# EAGLE design 2mono (EAGLE 6.1)
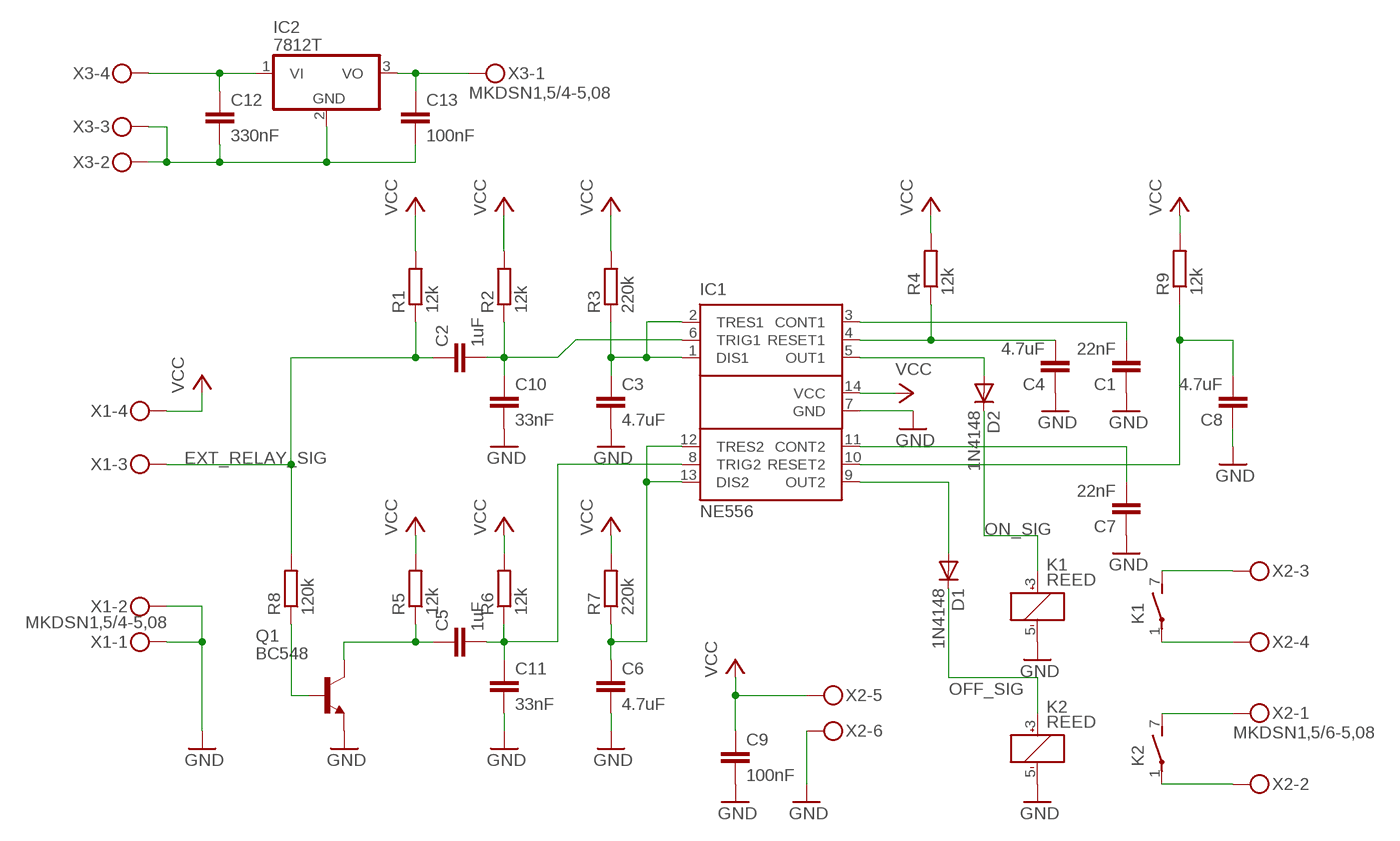
[diagram p0: schematic, sheet 1]

## Parts
C1  22nF  C-EU050-025X075  [C050-025X075]
C2  1uF  C-EU025-030X050  [C025-030X050]
C3  4.7uF  C-EU025-030X050  [C025-030X050]
C4  4.7uF  C-EU025-030X050  [C025-030X050]
C5  1uF  C-EU025-030X050  [C025-030X050]
C6  4.7uF  C-EU025-030X050  [C025-030X050]
C7  22nF  C-EU050-025X075  [C050-025X075]
C8  4.7uF  C-EU025-030X050  [C025-030X050]
C9  100nF  C-EU075-042X103  [C075-042X103]
C10  33nF  C-EU050-030X075  [C050-030X075]
C11  33nF  C-EU050-030X075  [C050-030X075]
C12  330nF  C-EU075-032X103  [C075-032X103]
C13  100nF  C-EU075-042X103  [C075-042X103]
D1  1N4148  1N4148DO35-10  [DO35-10]
D2  1N4148  1N4148DO35-10  [DO35-10]
IC1  NE556  [DIL14]
IC2  7812T  [TO220H]
K1  REED  [REED]
K2  REED  [REED]
Q1  BC548  [TO92-EBC]
R1  12k  R-EU_0207/12  [0207/12]
R2  12k  R-EU_0207/12  [0207/12]
R3  220k  R-EU_0207/12  [0207/12]
R4  12k  R-EU_0207/12  [0207/12]
R5  12k  R-EU_0207/12  [0207/12]
R6  12k  R-EU_0207/12  [0207/12]
R7  220k  R-EU_0207/12  [0207/12]
R8  120k  R-EU_0207/12  [0207/12]
R9  12k  R-EU_0207/12  [0207/12]
X1  MKDSN1,5/4-5,08  [MKDSN1,5/4-5,08]
X2  MKDSN1,5/6-5,08  [MKDSN1,5/6-5,08]
X3  MKDSN1,5/4-5,08  [MKDSN1,5/4-5,08]

## Nets
EXT_RELAY_SIG: C2.1 R1.1 R8.2 X1.3
GND: C1.1 C3.2 C4.1 C6.2 C7.1 C8.1 C9.2 C10.2 C11.2 IC1.7(GND) K1.5(1:-) K2.5(1:-) Q1.E X1.1 X1.2 X2.6
N$1: C3.1 IC1.1(DIS1) IC1.2(TRES1) R3.1
N$2: C2.2 C10.1 IC1.6(TRIG1) R2.1
N$3: C6.1 IC1.12(TRES2) IC1.13(DIS2) R7.1
N$4: C1.2 IC1.3(CONT1)
N$5: C4.2 IC1.4(RESET1) R4.1
N$6: C5.1 Q1.C R5.1
N$7: Q1.B R8.1
N$9: C5.2 C11.1 IC1.8(TRIG2) R6.1
N$10: C7.2 IC1.11(CONT2)
N$11: C8.2 IC1.10(RESET2) R9.1
N$12: D2.A IC1.5(OUT1)
N$14: K2.7(2:S) X2.1
N$15: K2.1(2:P) X2.2
N$16: K1.1(2:P) X2.4
N$17: D1.A IC1.9(OUT2)
N$19: C12.1 IC2.1(VI) X3.4
N$20: K1.7(2:S) X2.3
N$21: C13.1 IC2.3(VO) X3.1
N$22: C12.2 C13.2 IC2.2(GND) X3.2 X3.3
OFF_SIG: D1.C K2.3(1:+)
ON_SIG: D2.C K1.3(1:+)
VCC: C9.1 IC1.14(VCC) R1.2 R2.2 R3.2 R4.2 R5.2 R6.2 R7.2 R9.2 X1.4 X2.5

## Library data of the parts
C1-C13 = resistor:C-EU: CAPACITOR, European symbol
D1 D2 = diode:1N4148: DIODE high speed (Philips)
IC1 = st-microelectronics:NE556: General Purpose Biopolartimer
IC2 = linear:78*: Positive VOLTAGE REGULATOR Source: http://cache.national.com/ds/LM/LM78L05.pdf http://www.fairchildsemi.com/ds/LM/LM7805.pdf
K1 K2 = relay:REED: RELAY reed, 1 x norm. open with polarity, grid 5.08
Q1 = transistor-npn:BC548*: NPN Transistor
R1-R9 = resistor:R-EU_: RESISTOR, European symbol
X1 X3 = con-phoenix-508:MKDSN1,5/4-5,08: MKDSN 1,5/ 4-5,08 Printklemme Nennstrom: 13,5 A Nennspannung: 250 V Rastermaß: 5,08 mm Polzahl: 4 Anschlussart: Schraubanschluss Montage: Löten Anschlussrichtung Leiter/Platine: 0 ° Artikelnummer: 1729144 Source: http://eshop.phoenixcontact.com .. 1729144.pdf
X2 = con-phoenix-508:MKDSN1,5/6-5,08: MKDSN 1,5/ 6-5,08 Printklemme Nennstrom: 13,5 A Nennspannung: 250 V Rastermaß: 5,08 mm Polzahl: 6 Anschlussart: Schraubanschluss Montage: Löten Anschlussrichtung Leiter/Platine: 0 ° Artikelnummer: 1729160 Source: http://eshop.phoenixcontact.com .. 1729160.pdf

## Board
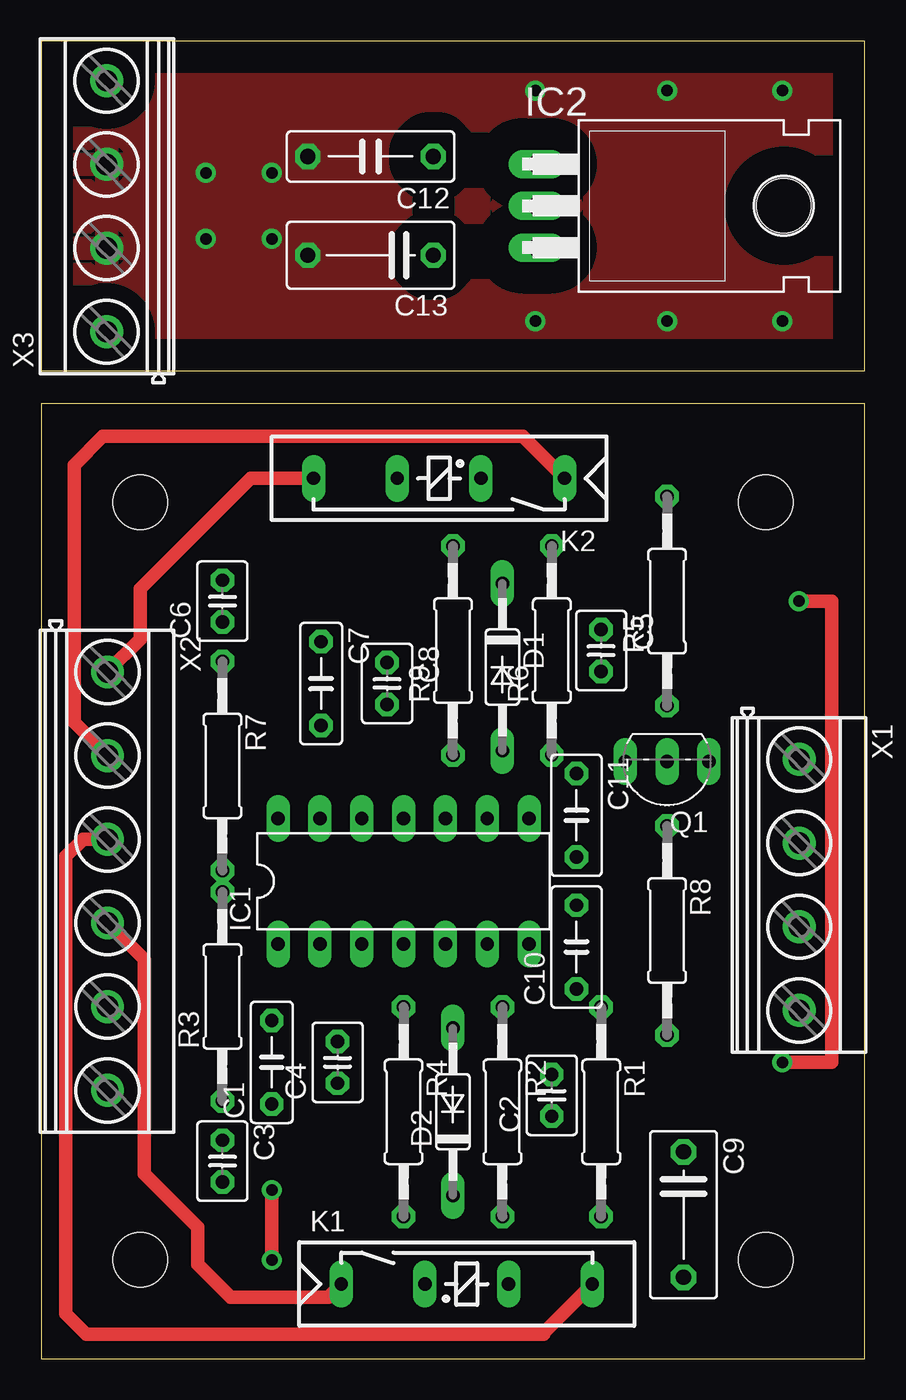
[diagram p1: board, top side]
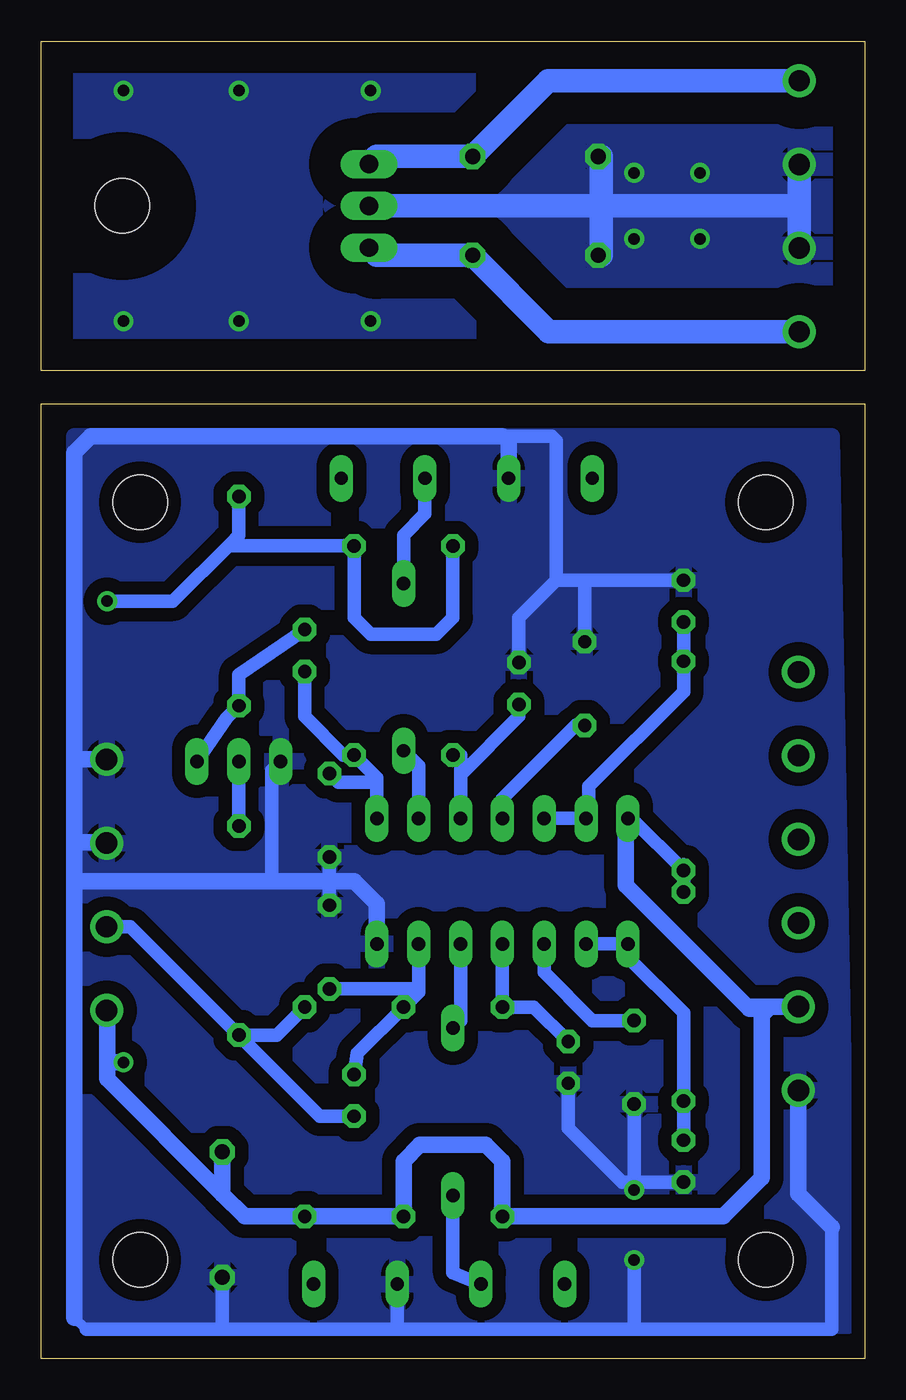
[diagram p2: board, bottom side, seen from below]

Size 50 x 80 mm. Coordinates in mm from the lower left corner, seen from the top.
Outline: 0,0 50,0 50,58 0,58 0,0
Outline: 0,80 0,60 50,60 50,80 0,80
Copper layers (1*16): Top 0.035mm / dielectric 1.5mm / Bottom 0.035mm
Design rules: minimum track width 8mil, minimum drill 20mil, track to track 8mil, track to pad 8mil, pad to pad 8mil, via to via 8mil, smd to smd 8mil, copper to edge 10mil, drill to drill 8mil, minimum pad ring 12mil, minimum via ring 10mil, stop-mask expansion 4mil, vias tented up to drill 25mil, thermal gap 10mil
Holes 3.3 mm at 6,6 6,52 44,52 44,6

### Footprints (pad centres in the part's own frame; a part is rotated, then mirrored left to right if it is on the bottom)
C050-025X075 = drill 0.813 octagon: 1 -2.54,0; 2 2.54,0
C025-030X050 = drill 0.813 octagon: 1 -1.27,0; 2 1.27,0
C075-042X103 = drill 0.914 octagon: 1 -3.81,0; 2 3.81,0
C050-030X075 = drill 0.813 octagon: 1 -2.54,0; 2 2.54,0
C075-032X103 = drill 0.914 octagon: 1 -3.81,0; 2 3.81,0
DO35-10 = drill 0.813 long: A 5.08,0; C -5.08,0
DIL14 = drill 0.813 long: 1 -7.62,-3.81; 2 -5.08,-3.81; 3 -2.54,-3.81; 4 0,-3.81; 5 2.54,-3.81; 6 5.08,-3.81; 7 7.62,-3.81; 8 7.62,3.81; 9 5.08,3.81; 10 2.54,3.81; 11 0,3.81; 12 -2.54,3.81; 13 -5.08,3.81; 14 -7.62,3.81
TO220H = drill 1.118 long: 1 -2.54,-10.16; 2 0,-10.16; 3 2.54,-10.16 | hole 3.302: 0,4.826
REED = drill 0.813 long: 1 -17.78,2.54; 3 -12.7,2.54; 5 -7.62,2.54; 7 -2.54,2.54
TO92-EBC = drill 0.813 long: B 0,-1.27; C -2.54,-1.27; E 2.54,-1.27
0207/12 = drill 0.813 octagon: 1 -6.35,0; 2 6.35,0
MKDSN1,5/4-5,08 = drill 1.3 pad 2: 1 -7.641,0.025; 2 -2.561,0.025; 3 2.519,0.025; 4 7.599,0.025
MKDSN1,5/6-5,08 = drill 1.3 pad 2: 1 -12.7,0.025; 2 -7.62,0.025; 3 -2.54,0.025; 4 2.54,0.025; 5 7.62,0.025; 6 12.7,0.025

### Placement (x,y rotation side)
C1  14,18 90 top
C2  31,16 90 top
C3  11,12 270 top
C4  18,18 90 top
C5  34,43 270 top
C6  11,46 90 top
C7  17,41 270 top
C8  21,41 270 top
C9  39,8.75 270 top
C10  32.5,25 90 top
C11  32.5,33 270 top
C12  20,73 180 top
C13  20,67 180 top
D1  28,42 270 top
D2  25,15 90 top
IC1  22,29 0 top
IC2  40.25,70 270 top
K1  36,2 0 top
K2  14,56 180 top
Q1  38,35 180 top
R1  34,15 270 top
R2  28,15 270 top
R3  11,22 90 top
R4  22,15 270 top
R5  38,46 90 top
R6  31,43 90 top
R7  11,36 270 top
R8  38,26 270 top
R9  25,43 90 top
X1  46,28.75 270 top
X2  4,29 270 top
X3  4,70 90 top

### Tracks (layer width: path | path; a pad name or v marks a point on that pad's centre or on a via)
EXT_RELAY_SIG
  Bottom 0.813: X1.3 44.58,26.23 R8.2 | R8.2 37.19,19.65 | C2.1 33.08,14.73 R8.2 | R1.1 35.7,19.65 R8.2
GND  (via drill 0.7)
  Top 0.813: v14,6 v14,10.25
  Bottom 0.61: 47.25,1.8 48,2.5
  Bottom 0.813: 14,10.73 C3.2 13.73,10.73 14,11 | 14,10.73 14.73,10.73 18,14 C4.1 | 14,10.73 14,11 | 14,11 C1.1 | v14,10.25 14,10.73 | 14,1.8 v14,6 | 2,8 2,1.8 14,1.8 | 47.62,31.38 48,31 48,36.25 48,36.39 | 17,47.27 C6.2 | 18.73,47.27 17,47.27 | 18.73,47.27 21,45 C8.1 | 17,47.27 C7.1 | 18.73,47.27 18.73,55.73 19,56 22,56 21.62,55.62 | 46.02,31.56 X1.2 46.09,31.38 | 14,1.8 28.38,1.8 | 28.38,1.8 K1.5 | 28.38,1.8 39,1.8 | 39,1.8 47.25,1.8 | Q1.E 36,35.73 36,29 | 39,1.8 C9.2 | C11.2 32.5,29 C10.2
  Bottom 1.016: 2,8 4.03,10.03 X2.6 | 22,56 47,56 48,55 48,36.39 X1.1 | 21.62,55.62 K2.5 | 47.62,31.38 46.09,31.38 | 48,2.5 48,29 | 48,29 48,36.25 | IC1.7 29.62,27.62 31,29 32.5,29 36,29 48,29
  pour Bottom (isolate 0.813): 48,56 2,56 1,2 47,2
N$1
  Bottom 0.813: C3.1 R3.1 11,21 14.38,24.38 IC1.1 IC1.2
N$2
  Bottom 0.813: IC1.6 27.08,22.27 27.18,22.18 | 27.18,22.18 R2.1 30.81,18.54 C2.2 | C10.1 27.46,22.46 27.18,22.18
N$3
  Bottom 0.813: C6.1 R7.1 11,40.5 16.75,34.75 16.75,32.73 IC1.13 IC1.12
N$4
  Bottom 0.813: IC1.3 19.46,23.46 16.54,20.54 C1.2
N$5
  Bottom 0.813: IC1.4 R4.1 20.08,21.35 C4.2
N$6
  Bottom 0.813: C5.1 38,41.54 R5.1 38.73,38.92 Q1.C
N$7
  Bottom 0.813: R8.1 Q1.B
N$9
  Bottom 0.813: 29.62,35 IC1.8 29.62,32.66 | 29.62,35 29.62,35.27 R6.1 31.65,36.65 34,39 C5.2 | C11.1 31.96,35 29.62,35
N$10
  Bottom 0.813: C7.2 17.54,38.46 22,34 IC1.11
N$11
  Bottom 0.813: C8.2 21,39 24.54,35.46 | IC1.10 24.54,35.46 | R9.1 24.54,36.65 24.54,35.46
N$12
  Bottom 0.813: IC1.5 24.54,20.54 D2.A
N$14
  Top 0.813: X2.1 6,43.67 6,46.75 12.71,53.46 K2.7
N$15
  Top 0.813: K2.1 29.25,56 3.75,56 2,54.25 2,38.65 X2.2
N$16
  Top 0.813: K1.1 17.43,3.75 11.5,3.75 9.5,5.75 9.5,8 6.25,11.25 6.25,24.25 X2.4
N$17
  Bottom 0.813: IC1.9 27.08,36 D1.A
N$19
  Bottom 1.422: X3.4 19.21,77.6 C12.1 29.63,73 IC2.1
N$20
  Top 0.813: X2.3 2.54,31.54 1.5,30.5 1.5,2.75 2.75,1.5 30.5,1.5 30.5,1.58 K1.7
N$21
  Bottom 1.422: X3.1 19.17,62.36 C13.1 29.63,67 IC2.3
N$22  (via drill 0.7)
  Bottom 1.422: X3.2 3.98,70 | 3.98,70 X3.3 | 3.98,70 16,70 | 16,70 IC2.2 | C12.2 16,73 16,70 | 16,67 C13.2 16,67.19 16,70
  other vias: 10,72 10,68 14,68 14,72 30,63 38,63 45,63 30,77 38,77 45,77
  pour Bottom (isolate 1.93): 1,79 1,61 49,61 49,79
  pour Top (isolate 1.93): 1,79 49,79 49,61 1,61
OFF_SIG
  Bottom 0.813: K2.3 26.7,51.3 28,50 D1.C
ON_SIG
  Bottom 0.813: D2.C 25,5.24 K1.3
VCC  (via drill 0.7)
  Top 0.813: v46,46 48,46 48,18 v45,18
  Bottom 0.813: R7.2 11,30 | 14.5,32.68 IC1.14 14.16,32.81 R7.2 | R7.2 R3.2 | R5.2 38,50 38.5,49.5 | 38.5,49.5 42,46 v46,46 | 38.5,49.5 38.35,49.35 R6.2 31,45 30,44 26,44 25,45 R9.2 | 6.25,21.25 6.25,20.75 5.87,21.13
  Bottom 1.016: 14.5,32.68 14.5,29.25 | 39,10 37.65,8.65 R1.2 R2.2 28,12 27,13 23,13 22,12 R4.2 8.6,8.65 6.25,11 6.25,20.75 | 39,10 46,17 46,18 | 7,21.25 14.5,28.75 14.5,32.44 IC1.14 | X2.5 6.87,21.38 7,21.25 | 6.25,21.25 7,21.25 | 39,10 C9.1 | X1.4 46,21.13 46,18 | 46,18 v45,18

### Text on the board
tlabels: +14-27V | gnd | gnd | +12V | off signal | off | off | on | on | +12V | gnd | gnd | gnd | on signal | trigg | +12V | peter 2011